# Altium project SL1 Xilinx Spartan-IIE PQ208 Rev1.02.PrjPcb
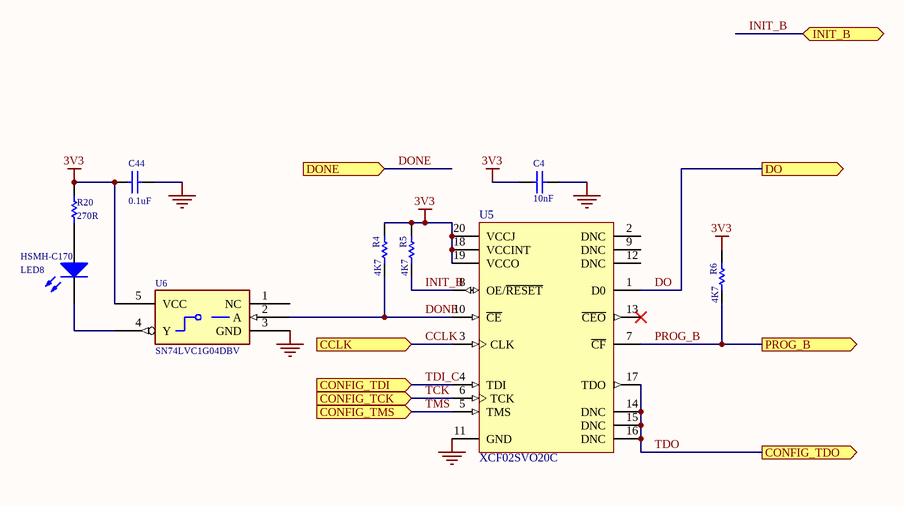
[diagram p0: SL_Config_2E.SchDoc]
4 sheets, 38 parts. Net scope: flat (ports and power ports of the same name join across sheets).
Board file: SL1 Xilinx Spartan-IIE PQ208 Rev1.02.PcbDoc
Sheets:
  SL_Config_2E.SchDoc
  SL_LCD_SW_LED_2E.SchDoc
  Sheet2.SchDoc
  Sheet3.SchDoc

## Sheet SL_Config_2E.SchDoc: FPGA Configuration
size A; Organization: Altium Limited; Address1: L3, 12a Rodborough Rd; Address2: Frenchs Forest; Address3: NSW; Address4: Australia 2086; DocumentNumber: 2; SheetNumber: 2; SheetTotal: 5; Library Name: SpiritLevel_2E.SchLib

### Parts
C4  10nF  [CC1608-0603]
C44  0.1uF  [CC2012-0805]
LED8  HSMH-C170  [SMD _LED]
R4  4K7  [CR2012-0805]
R5  4K7  [CR2012-0805]
R6  4K7  [CR2012-0805]
R20  270R  [CR2012-0805]
U5  XCF02SVO20C  [VO20]
U6  SN74LVC1G04DBV  [SO-G5/P.95]

### Ports
CCLK (in), CONFIG_TCK (in), CONFIG_TDI (in), CONFIG_TDO (out), CONFIG_TMS (in), DO (out), DONE (in), INIT_B (bidir), PROG_B (out)

### Nets
3V3: C4.1 C44.2 R4.1 R5.1 R6.1 R20.2 U5.18(VCCINT) U5.19(VCCO) U5.20(VCCJ) U6.5(VCC)  [project net TEST]
GND: C4.2 C44.1 U5.11(GND) U6.3(GND)
CCLK: U5.3(CLK) ; port CCLK
DO: U5.1(D0) ; port DO
DONE: R4.2 U5.10(~{CE}) U6.2(A) ; port DONE
INIT_B: R5.2 U5.8(OE/~{RESET}) ; port INIT_B
PROG_B: R6.2 U5.7(~{CF}) ; port PROG_B
TCK: U5.6(TCK) ; port CONFIG_TCK
TDI_C: U5.4(TDI) ; port CONFIG_TDI
TDO: U5.14(DNC) U5.15(DNC) U5.16(DNC) U5.17(TDO) ; port CONFIG_TDO
TMS: U5.5(TMS) ; port CONFIG_TMS
NetLED8_1: LED8.1(A) R20.1
NetLED8_2: LED8.2(K) U6.4(Y)

Not connected (* = marked no-connect by the designer): U5 2(DNC) 9(DNC) 12(DNC) 13(~{CEO})*; U6 1(NC)

### Notes on the sheet
- Title
- Size:
- Date:
- A
- Number:
- Time:
- Revision:
- Sheet
- of
- File:

### Library data of the parts
C4 = CAP: Capacitor; AEMS Code: 2100341
C44 = CAP: Capacitor; Supplier: FARNELL; Supplier Code: 317-287
LED8 = HSMX-C670: Typical RED GaAs SMD LED Agilent make; AEMS Code: 2610081; Revision: July-2002: Re-released for DXP Platform.
R4-R6 = RES: Resistor; AEMS Code: 1200226
R20 = RES: Resistor; AEMS Code: 1200430
U5 = XCF02SVO20C: XCF00S Series, Platform Flash In-System Programmable Configuration 3.3V PROM, 20-Pin TSOP, 2-Megabit, Commercial Grade; PackageDocument: ver1.0, May-2003; AEMS Code: CHANGED VALUE; DatasheetDocument: ver2.3, May-2004; PackageReference: VO20; Code_JEDEC: MO-153-AC
U6 = SN74AHC1G04DBVR: Manufacturer: TI

## Sheet SL_LCD_SW_LED_2E.SchDoc: LCD, Switches and LEDs
size B; Organization: Altium Limited; Address1: L3, 12a Rodborough Rd; Address2: Frenchs Forest; Address3: NSW; Address4: Australia 2086; DocumentNumber: 3; SheetNumber: 3; SheetTotal: 5; Library Name: SpiritLevel_2E.SchLib
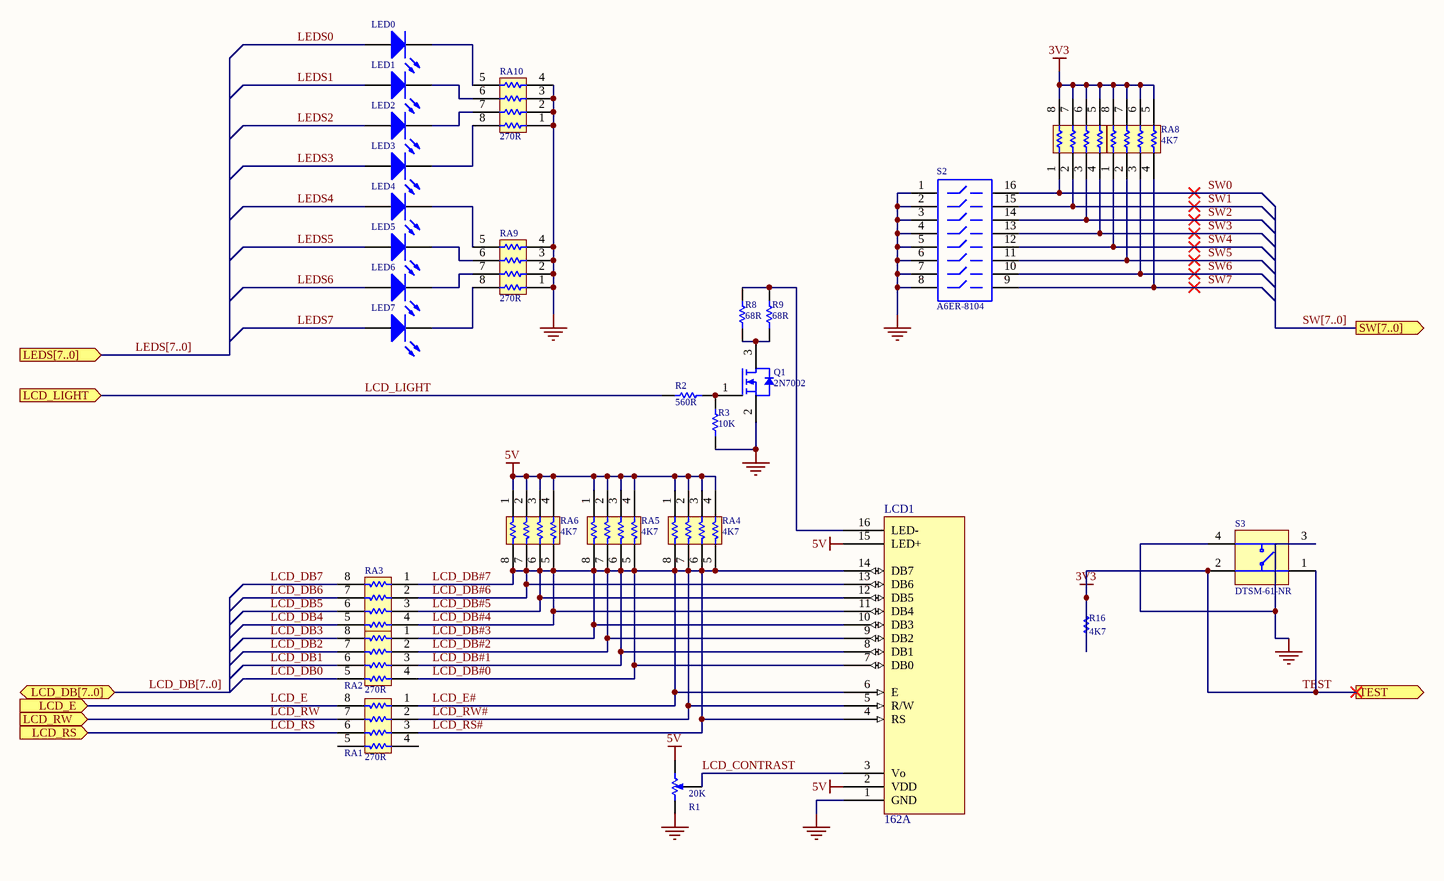
[diagram p1: SL_LCD_SW_LED_2E.SchDoc]

### Parts
LCD1  162A  [162A]
LED0  HSMH-C170  [SMD _LED]  (value not drawn)
LED1  HSMH-C170  [SMD _LED]  (value not drawn)
LED2  HSMH-C170  [SMD _LED]  (value not drawn)
LED3  HSMH-C170  [SMD _LED]  (value not drawn)
LED4  HSMH-C170  [SMD _LED]  (value not drawn)
LED5  HSMH-C170  [SMD _LED]  (value not drawn)
LED6  HSMH-C170  [SMD _LED]  (value not drawn)
LED7  HSMH-C170  [SMD _LED]  (value not drawn)
Q1  2N7002  [SO-G3]
R1  20K  [POT4MM-2]
R2  560R  [CC2012-0805]
R3  10K  [CC2012-0805]
R8  68R  [CC2012-0805]
R9  68R  [CC2012-0805]
R16  4K7  [CC2012-0805]
RA1  270R  [MNR34]
RA2  270R  [MNR34]
RA3  270R  [MNR34]
RA4  4K7  [MNR34T]
RA5  4K7  [MNR34T]
RA6  4K7  [MNR34T]
RA7  4K7  [MNR34T]
RA8  4K7  [MNR34T]
RA9  270R  [MNR34T]
RA10  270R  [MNR34T]
S2  A6ER-8104  [DIP-16-KEY]
S3  DTSM-61-NR  [B3FS_SWITCH]

### Ports
LCD_DB[7..0] (bidir), LCD_E (in), LCD_LIGHT (in), LCD_RS (in), LCD_RW (in), LEDS[7..0] (in), SW[7..0] (out), TEST (out)

### Nets
5V: LCD1.2(VDD) LCD1.15(LED+) R1.CW(+) RA4.1 RA4.2 RA4.3 RA4.4 RA5.1 RA5.2 RA5.3 RA5.4 RA6.1 RA6.2 RA6.3 RA6.4
GND: LCD1.1(GND) Q1.2 R1.CCW(-) R3.1 RA9.1 RA9.2 RA9.3 RA9.4 RA10.1 RA10.2 RA10.3 RA10.4 S2.1 S2.2 S2.3 S2.4 S2.5 S2.6 S2.7 S2.8 S3.3 S3.4
TEST: R16.1 R16.2 RA7.5 RA7.6 RA7.7 RA7.8 RA8.5 RA8.6 RA8.7 RA8.8 S3.1 S3.2 ; port TEST  [also labelled 3V3]
LCD_CONTRAST: LCD1.3(Vo) R1.W
LCD_DB0: RA2.5
LCD_DB1: RA2.6
LCD_DB2: RA2.7
LCD_DB3: RA2.8
LCD_DB4: RA3.5
LCD_DB5: RA3.6
LCD_DB6: RA3.7
LCD_DB7: RA3.8
LCD_DB#0: LCD1.4(RS) LCD1.5(R/W) LCD1.6(E) LCD1.7(DB0) LCD1.8(DB1) LCD1.9(DB2) LCD1.10(DB3) LCD1.11(DB4) LCD1.12(DB5) LCD1.13(DB6) LCD1.14(DB7) RA1.1 RA1.2 RA1.3 RA2.1 RA2.2 RA2.3 RA2.4 RA3.1 RA3.2 RA3.3 RA3.4 RA4.5 RA4.6 RA4.7 RA4.8 RA5.5 RA5.6 RA5.7 RA5.8 RA6.5 RA6.6 RA6.7 RA6.8  [also labelled LCD_DB#1, LCD_DB#2, LCD_DB#3, LCD_DB#4, LCD_DB#5, LCD_DB#6, LCD_DB#7, LCD_E#, LCD_RS#, LCD_RW#]
LCD_E: RA1.8 ; port LCD_E
LCD_LIGHT: R2.1 ; port LCD_LIGHT
LCD_RS: RA1.6 ; port LCD_RS
LCD_RW: RA1.7 ; port LCD_RW
LEDS0: LED0.1(A)
LEDS1: LED1.1(A)
LEDS2: LED2.1(A)
LEDS3: LED3.1(A)
LEDS4: LED4.1(A)
LEDS5: LED5.1(A)
LEDS6: LED6.1(A)
LEDS7: LED7.1(A)
SW0: RA7.1 S2.16
SW1: RA7.2 S2.15
SW2: RA7.3 S2.14
SW3: RA7.4 S2.13
SW4: RA8.1 S2.12
SW5: RA8.2 S2.11
SW6: RA8.3 S2.10
SW7: RA8.4 S2.9
NetLCD1_16: LCD1.16(LED-) R8.1 R9.1
NetLED0_2: LED0.2(K) RA10.5
NetLED1_2: LED1.2(K) RA10.6
NetLED2_2: LED2.2(K) RA10.7
NetLED3_2: LED3.2(K) RA10.8
NetLED4_2: LED4.2(K) RA9.5
NetLED5_2: LED5.2(K) RA9.6
NetLED6_2: LED6.2(K) RA9.7
NetLED7_2: LED7.2(K) RA9.8
NetQ1_1: Q1.1 R2.2 R3.2
NetQ1_3: Q1.3 R8.2 R9.2

Not connected (* = marked no-connect by the designer): RA1 4 5

### Buses and harness runs
bus LCD_DB[7..0] = port LCD_DB[7..0]
bus LEDS[7..0] = port LEDS[7..0]
bus SW[7..0] = port SW[7..0]

### Notes on the sheet
- Title
- Size:
- Date:
- B
- Number:
- Time:
- Revision:
- Sheet
- of
- File:

### Library data of the parts
LCD1 = 162A: 16 char * 2 line LCD character display with b/light
LED0-LED7 = HSMX-C670: as LED8 on sheet SL_Config_2E; Revision: July-2002: Re-released for DXP Platform.
Q1 = 2N7002: N Channel Mosfet
R1 = RPot SM: Square Trimming Potentiometer; AEMS Code: 1400226
R2 = RES: Resistor; AEMS Code: 1200723
R3 = RES: Resistor; AEMS Code: 1200006JT
R8 R9 = RES: Resistor; AEMS Code: 1200821
R16 = RES: Resistor; AEMS Code: 1200226
RA1-RA3 RA9 RA10 = MNR34: 3216x4 Resistor Array; AEMS Code: 1310010
RA4-RA8 = MNR34: 3216x4 Resistor Array; AEMS Code: 1300330
S2 = A6ER-8104: DIP Switch Side actuator long liver Piano Key; Revision: July-2002: Re-released for DXP Platform.
S3 = B3FS: SPNA SMD Keyboard Switch

## Sheet Sheet2.SchDoc
size A
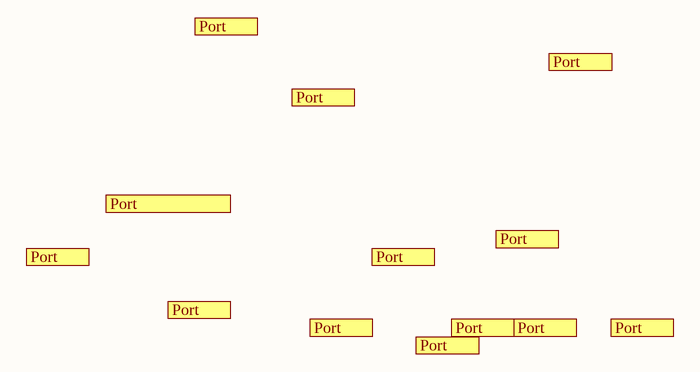
[diagram p2: Sheet2.SchDoc]

### Ports
Port

## Sheet Sheet3.SchDoc
size A
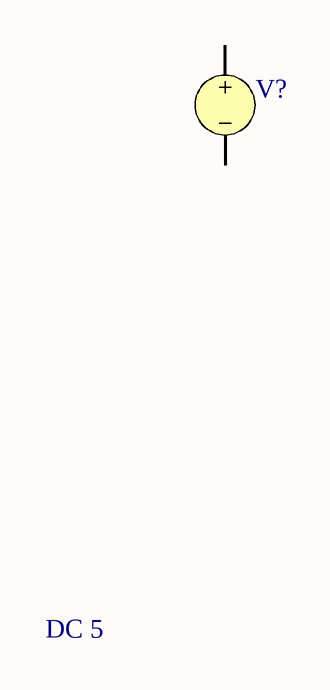
[diagram p3: Sheet3.SchDoc]

### Parts
V?  DC 5

### Nets

Not connected (* = marked no-connect by the designer): V? 1 2

### Library data of the parts
V? = VSRC: Voltage Source; Note: PCB Footprint - Not required; AC Magnitude: 1; AC Phase: 0; Value: 5; Published: 8-Jun-2000; LatestRevisionDate: 17-Jul-2002; LatestRevisionNote: Re-released for DXP Platform.; PackageReference: Not Applicable; Publisher: Altium Limited

## Nets that join several sheets
GND: SL_Config_2E (C4.2 C44.1 U5.11 U6.3), SL_LCD_SW_LED_2E (22 pins)
TEST: SL_Config_2E (10 pins), SL_LCD_SW_LED_2E (12 pins)